# EAGLE design deploy_sch (EAGLE 9.1.0)

## Sheet 1 of 2
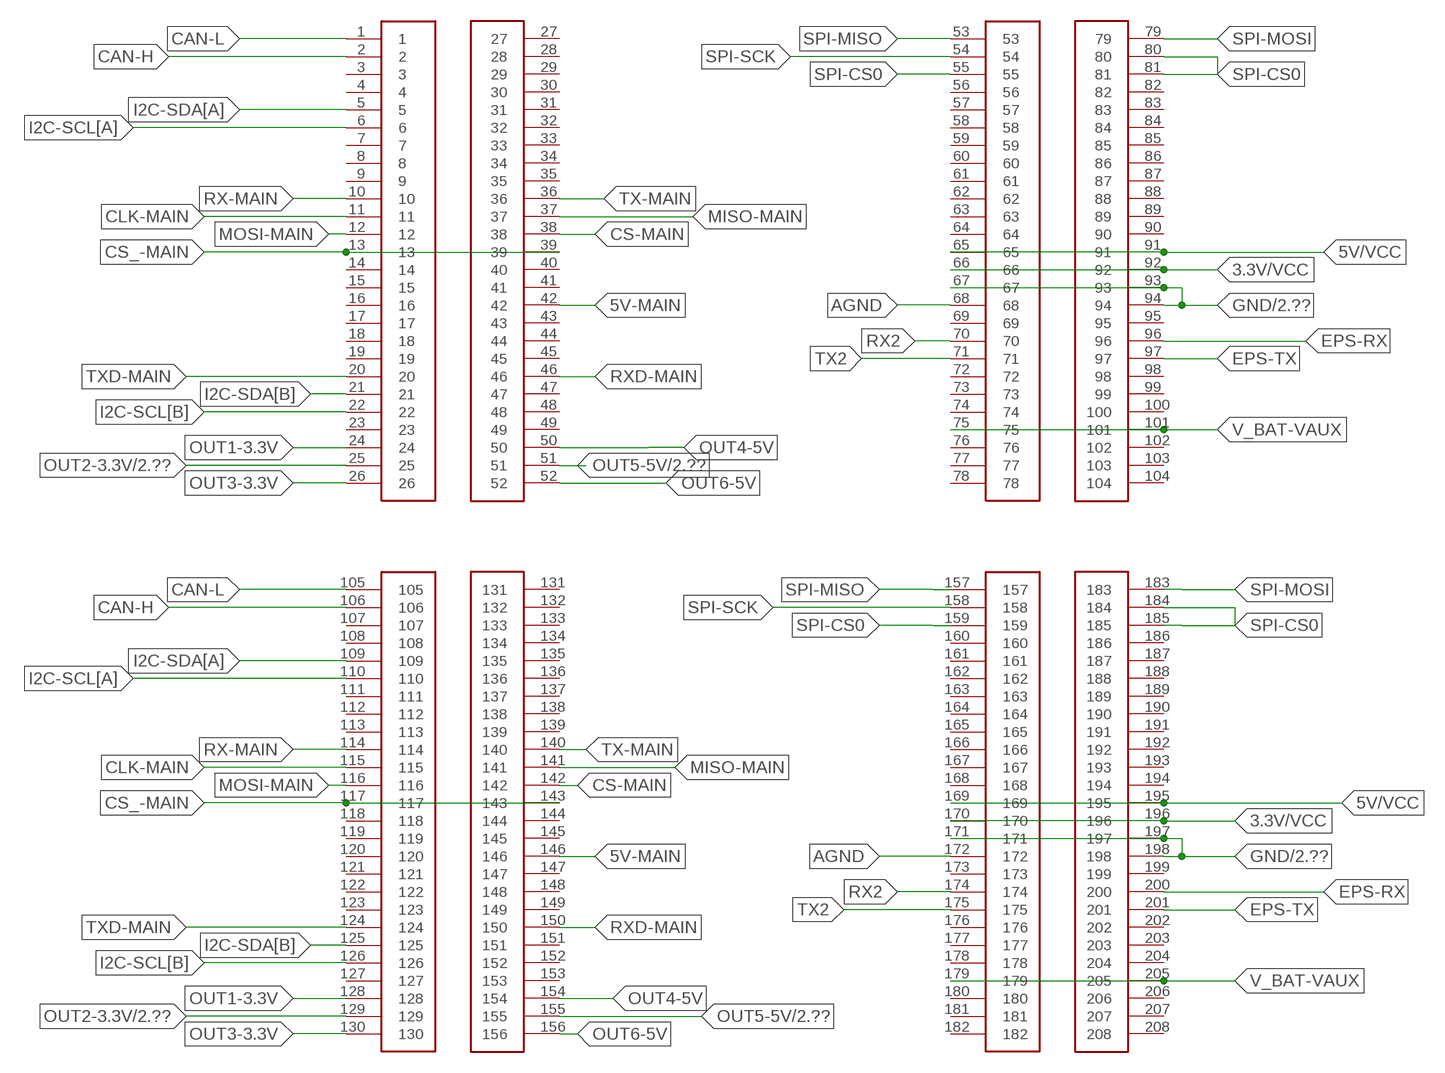
[diagram p0: schematic, sheet 1]

### Parts
U$1  SUCHAI_STACKBREAKOUT  [SUCHAI_STACKBREAKOUT]

### Nets
3.3V/VCC: U$1.66 U$1.92 U$1.170 U$1.196
5V-MAIN: U$1.42 U$1.146
5V/VCC: U$1.65 U$1.91 U$1.169 U$1.195
AGND: U$1.68 U$1.172
CAN-H: U$1.2 U$1.106
CAN-L: U$1.1 U$1.105
CLK-MAIN: U$1.11 U$1.115
CS-MAIN: U$1.38 U$1.142
CS_-MAIN: U$1.13 U$1.39 U$1.117 U$1.143
EPS-RX: U$1.96 U$1.200
EPS-TX: U$1.97 U$1.201
GND: U$1.67 U$1.93 U$1.94 U$1.171 U$1.197 U$1.198 ; also sheet 2
I2C-SCL[A]: U$1.6 U$1.110
I2C-SCL[B]: U$1.22 U$1.126
I2C-SDA[A]: U$1.5 U$1.109
I2C-SDA[B]: U$1.21 U$1.125
MISO-MAIN: U$1.37 U$1.141
MOSI-MAIN: U$1.12 U$1.116
OUT1-3.3V: U$1.24 U$1.128
OUT2-3.3V: U$1.25 U$1.129 ; also sheet 2
OUT3-3.3V: U$1.26 U$1.130
OUT4-5V: U$1.50 U$1.154
OUT5-5V: U$1.51 U$1.155 ; also sheet 2
OUT6-5V: U$1.52 U$1.156
RX2: U$1.70 U$1.174
RX-MAIN: U$1.10 U$1.114
RXD-MAIN: U$1.46 U$1.150
SPI-CS0: U$1.55 U$1.80 U$1.81 U$1.159 U$1.184 U$1.185
SPI-MISO: U$1.53 U$1.157
SPI-MOSI: U$1.79 U$1.183
SPI-SCK: U$1.54 U$1.158
TX2: U$1.71 U$1.175
TX-MAIN: U$1.36 U$1.140
TXD-MAIN: U$1.20 U$1.124
V_BAT-VAUX: U$1.75 U$1.101 U$1.179 U$1.205
Unconnected: U$1.3 U$1.4 U$1.7 U$1.8 U$1.9 U$1.14 U$1.15 U$1.16 U$1.17 U$1.18 U$1.19 U$1.23 U$1.27 U$1.28 U$1.29 U$1.30 U$1.31 U$1.32 U$1.33 U$1.34 U$1.35 U$1.40 U$1.41 U$1.43 U$1.44 U$1.45 U$1.47 U$1.48 U$1.49 U$1.56 U$1.57 U$1.58 U$1.59 U$1.60 U$1.61 U$1.62 U$1.63 U$1.64 U$1.69 U$1.72 U$1.73 U$1.74 U$1.76 U$1.77 U$1.78 U$1.82 U$1.83 U$1.84 U$1.85 U$1.86 U$1.87 U$1.88 U$1.89 U$1.90 U$1.95 U$1.98 U$1.99 U$1.100 U$1.102 U$1.103 U$1.104 U$1.107 U$1.108 U$1.111 U$1.112 U$1.113 U$1.118 U$1.119 U$1.120 U$1.121 U$1.122 U$1.123 U$1.127 U$1.131 U$1.132 U$1.133 U$1.134 U$1.135 U$1.136 U$1.137 U$1.138 U$1.139 U$1.144 U$1.145 U$1.147 U$1.148 U$1.149 U$1.151 U$1.152 U$1.153 U$1.160 U$1.161 U$1.162 U$1.163 U$1.164 U$1.165 U$1.166 U$1.167 U$1.168 U$1.173 U$1.176 U$1.177 U$1.178 U$1.180 U$1.181 U$1.182 U$1.186 U$1.187 U$1.188 U$1.189 U$1.190 U$1.191 U$1.192 U$1.193 U$1.194 U$1.199 U$1.202 U$1.203 U$1.204 U$1.206 U$1.207 U$1.208

## Sheet 2 of 2
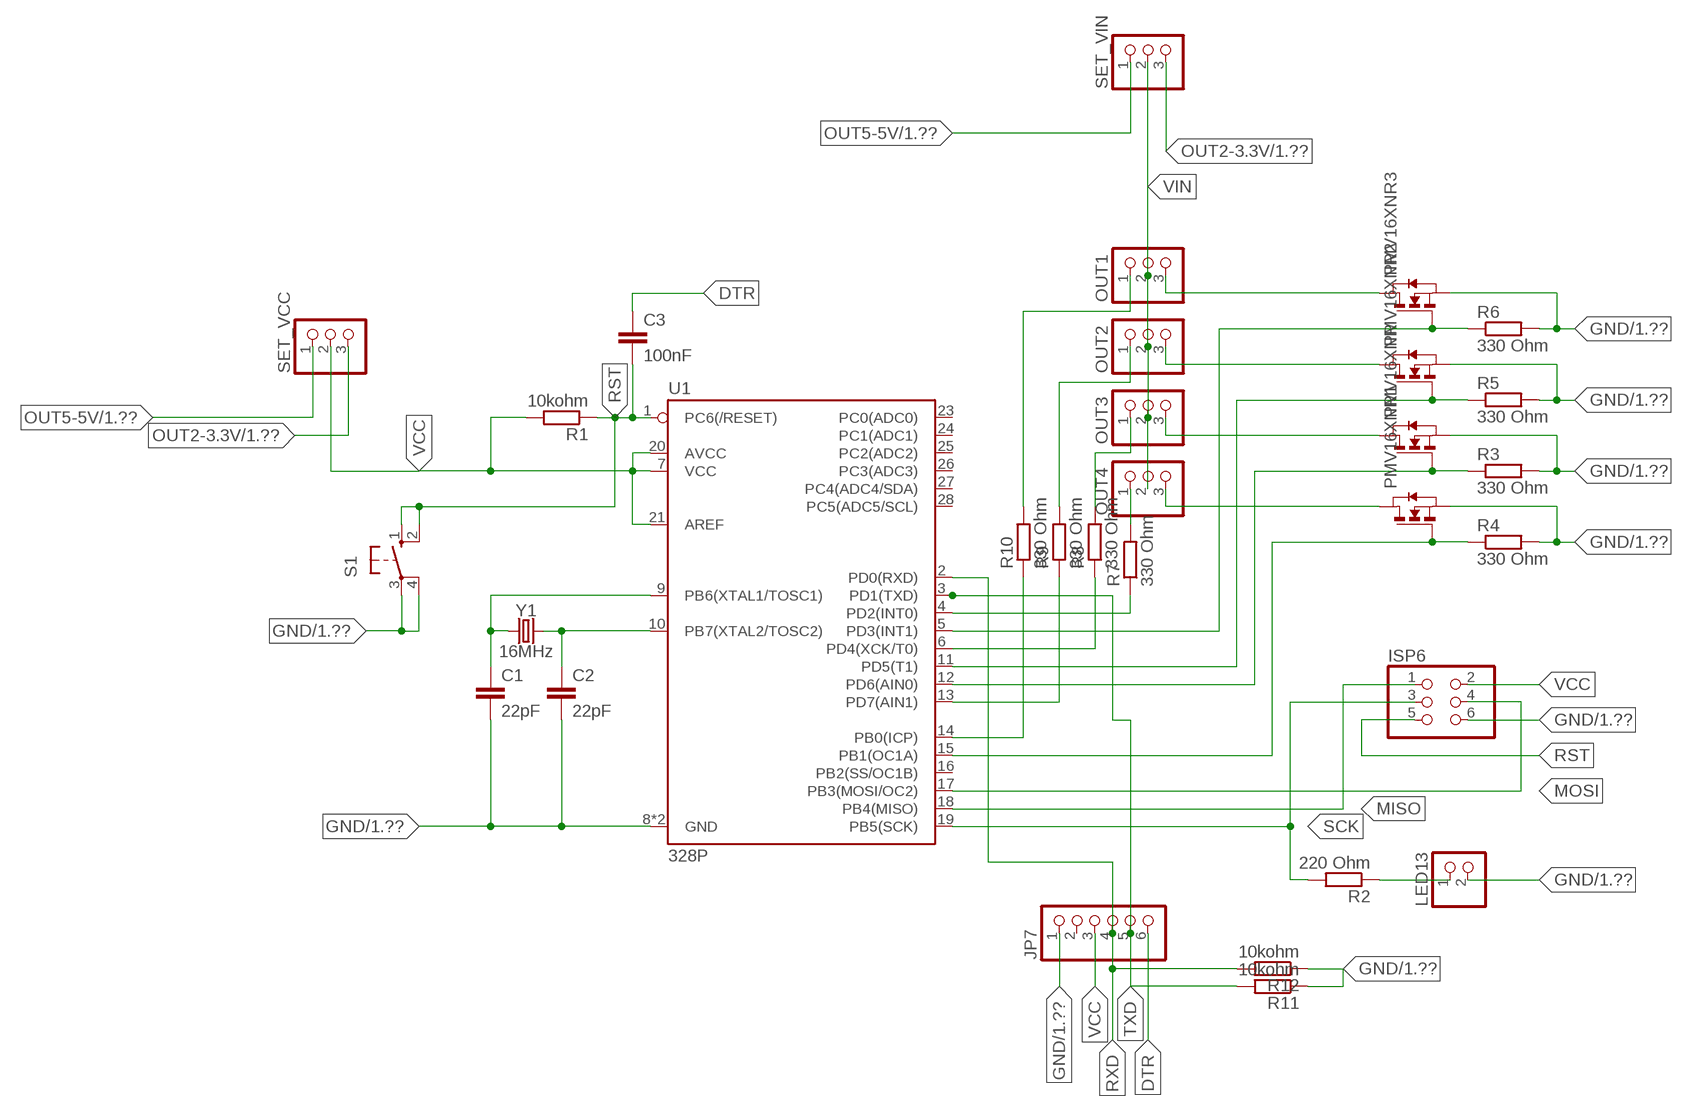
[diagram p1: schematic, sheet 2]

### Parts
C1  22pF  C-EU025-025X050  [C025-025X050]
C2  22pF  C-EU025-025X050  [C025-025X050]
C3  100nF  C-EU025-025X050  [C025-025X050]
ISP6  PINHD-2X3  [2X03]
JP7  PINHD-1X6  [1X06]
LED13  PINHD-1X2  [1X02]
OUT1  PINHD-1X3  [1X03]
OUT2  PINHD-1X3  [1X03]
OUT3  PINHD-1X3  [1X03]
OUT4  PINHD-1X3  [1X03]
PMV16XNR  NMOSSOT23  [SOT-23]
PMV16XNR1  NMOSSOT23  [SOT-23]
PMV16XNR2  NMOSSOT23  [SOT-23]
PMV16XNR3  NMOSSOT23  [SOT-23]
R1  10kohm  R-EU_0204/7  [0204/7]
R2  220 Ohm  R-EU_0204/7  [0204/7]
R3  330 Ohm  R-EU_0204/7  [0204/7]
R4  330 Ohm  R-EU_0204/7  [0204/7]
R5  330 Ohm  R-EU_0204/7  [0204/7]
R6  330 Ohm  R-EU_0204/7  [0204/7]
R7  330 Ohm  R-EU_0204/7  [0204/7]
R8  330 Ohm  R-EU_0204/7  [0204/7]
R9  330 Ohm  R-EU_0204/7  [0204/7]
R10  330 Ohm  R-EU_0204/7  [0204/7]
R11  10kohm  R-EU_0204/7  [0204/7]
R12  10kohm  R-EU_0204/7  [0204/7]
S1  10-XX  [B3F-10XX]
SET_VCC  PINHD-1X3  [1X03]
SET_VIN  PINHD-1X3  [1X03]
U1  328P  ATMEGA328P_PDIP  [DIP28]
Y1  16MHz  CRYSTAL-16MHZPTH-HC49US  [HC49US]

### Nets
DTR: C3.1 JP7.6
GND: C1.2 C2.2 ISP6.6 JP7.1 LED13.2 PMV16XNR1.2(S) PMV16XNR2.2(S) PMV16XNR3.2(S) PMV16XNR.2(S) R3.2 R4.2 R5.2 R6.2 R11.1 R12.1 S1.3(P) S1.4(P1) U1.8(GND) U1.22(GND) ; also sheet 1
MISO: ISP6.1 U1.18(PB4(MISO))
MOSI: ISP6.4 U1.17(PB3(MOSI/OC2))
N$1: C1.1 U1.9(PB6(XTAL1/TOSC1)) Y1.1
N$2: C2.1 U1.10(PB7(XTAL2/TOSC2)) Y1.2
N$3: PMV16XNR.3(G) R3.1 U1.12(PD6(AIN0))
N$4: LED13.1 R2.1
N$5: PMV16XNR1.3(G) R4.1 U1.15(PB1(OC1A))
N$6: PMV16XNR2.3(G) R5.1 U1.11(PD5(T1))
N$7: PMV16XNR3.3(G) R6.1 U1.5(PD3(INT1))
N$8: OUT4.3 PMV16XNR1.1(D)
N$9: OUT3.3 PMV16XNR.1(D)
N$10: OUT2.3 PMV16XNR2.1(D)
N$11: OUT1.3 PMV16XNR3.1(D)
N$12: OUT4.1 R7.2
N$13: R7.1 U1.4(PD2(INT0))
N$14: OUT3.1 R8.2
N$15: R8.1 U1.6(PD4(XCK/T0))
N$16: R9.1 U1.13(PD7(AIN1))
N$17: OUT2.1 R9.2
N$18: OUT1.1 R10.2
N$19: R10.1 U1.14(PB0(ICP))
OUT2-3.3V: SET_VCC.3 SET_VIN.3 ; also sheet 1
OUT5-5V: SET_VCC.1 SET_VIN.1 ; also sheet 1
RST: C3.2 ISP6.5 R1.1 S1.1(S) S1.2(S1) U1.1(PC6(/RESET))
RXD: JP7.4 R12.2 U1.2(PD0(RXD))
SCK: ISP6.3 R2.2 U1.19(PB5(SCK))
TXD: JP7.5 R11.2 U1.3(PD1(TXD))
VCC: ISP6.2 JP7.3 R1.2 SET_VCC.2 U1.7(VCC) U1.20(AVCC) U1.21(AREF)
VIN: OUT1.2 OUT2.2 OUT3.2 OUT4.2 SET_VIN.2
Unconnected: JP7.2 U1.16(PB2(SS/OC1B)) U1.23(PC0(ADC0)) U1.24(PC1(ADC1)) U1.25(PC2(ADC2)) U1.26(PC3(ADC3)) U1.27(PC4(ADC4/SDA)) U1.28(PC5(ADC5/SCL))

## Library data of the parts
C1-C3 = resistor:C-EU: CAPACITOR, European symbol
ISP6 = pinhead:PINHD-2X3: PIN HEADER
JP7 = pinhead:PINHD-1X6: PIN HEADER
LED13 = pinhead:PINHD-1X2: PIN HEADER
OUT1-OUT4 SET_VCC SET_VIN = pinhead:PINHD-1X3: PIN HEADER
PMV16XNR PMV16XNR1-PMV16XNR3 = zetex:NMOSSOT23: MOS FET; OC_FARNELL: unknown; OC_NEWARK: unknown
R1-R12 = resistor:R-EU_: RESISTOR, European symbol
S1 = switch-omron:10-XX: OMRON SWITCH; MPN: B3F-1000; OC_FARNELL: 176432; OC_NEWARK: 36M3542
U1 = SparkFun-IC-Microcontroller:ATMEGA328P_PDIP: Atmel 328P Through hole ATMEGA328P uC used in the Arduino 32kb flash, 1k EEPROM, 2k SRAM Datasheet <http://www.sparkfun.com/datasheets/Components/SMD/ATMega328.pdf> SparkFun Products Storefront component: AVR 28 Pin 20MHz 32K 6A/D - ATMega328P <https://www.sparkfun.com/products/9061> (COM-09061) SparkFun Simon Says - Through-Hole Soldering Kit <https://www.sparkfun.com/products/10547> (KIT-10547) SparkFun Learn to Solder - Simon Says <https://www.sparkfun.com/products/13708> (KIT-13708) SparkFun BigTime Watch Kit <https://www.sparkfun.com/products/11734> (KIT-11734) SparkFun ClockIt <https://www.sparkfun.com/products/10930> (KIT-10930) SparkFun Serial Enabled LCD Kit <https://www.sparkfun.com/products/10097> (LCD-10097) SparkFun Simon Tilts - Through Hole Soldering Kit <https://www.sparkfun.com/products/12634> (KIT-12634) SparkFun Frequency Counter Kit <https://www.sparkfun.com/products/10140> (KIT-10140) FabFM Radio Kit <https://www.sparkfun.com/products/11043> (KIT-11043) SparkFun Binary Blaster Kit <https://www.sparkfun.com/products/12037> (KIT-12037) SparkFun Metro-Gnome <https://www.sparkfun.com/products/9236> (KIT-09236) ATmega328 with Arduino Optiboot (Uno) <https://www.sparkfun.com/products/10524> (DEV-10524); PROD_ID: IC-09136
U$1 = SUCHAI_PCB:SUCHAI_STACKBREAKOUT
Y1 = SparkFun-Clocks:CRYSTAL-16MHZ: 16MHz Crystal Digikey Example <http://www.digikey.com/product-search/en?keywords=535-9122-1-ND> Frequency: 16MHz Frequency Stability: ±50ppm Frequency Tolerance: ±20ppm Load Capacitance: 18pF SparkFun Products: Pro Micro -5V/16MHz <https://www.sparkfun.com/products/12640> SparkFun Serial Enabled LCD Kit <https://www.sparkfun.com/products/10097>; PROD_ID: XTAL-08181; SF_ID: COM-00536

## Board
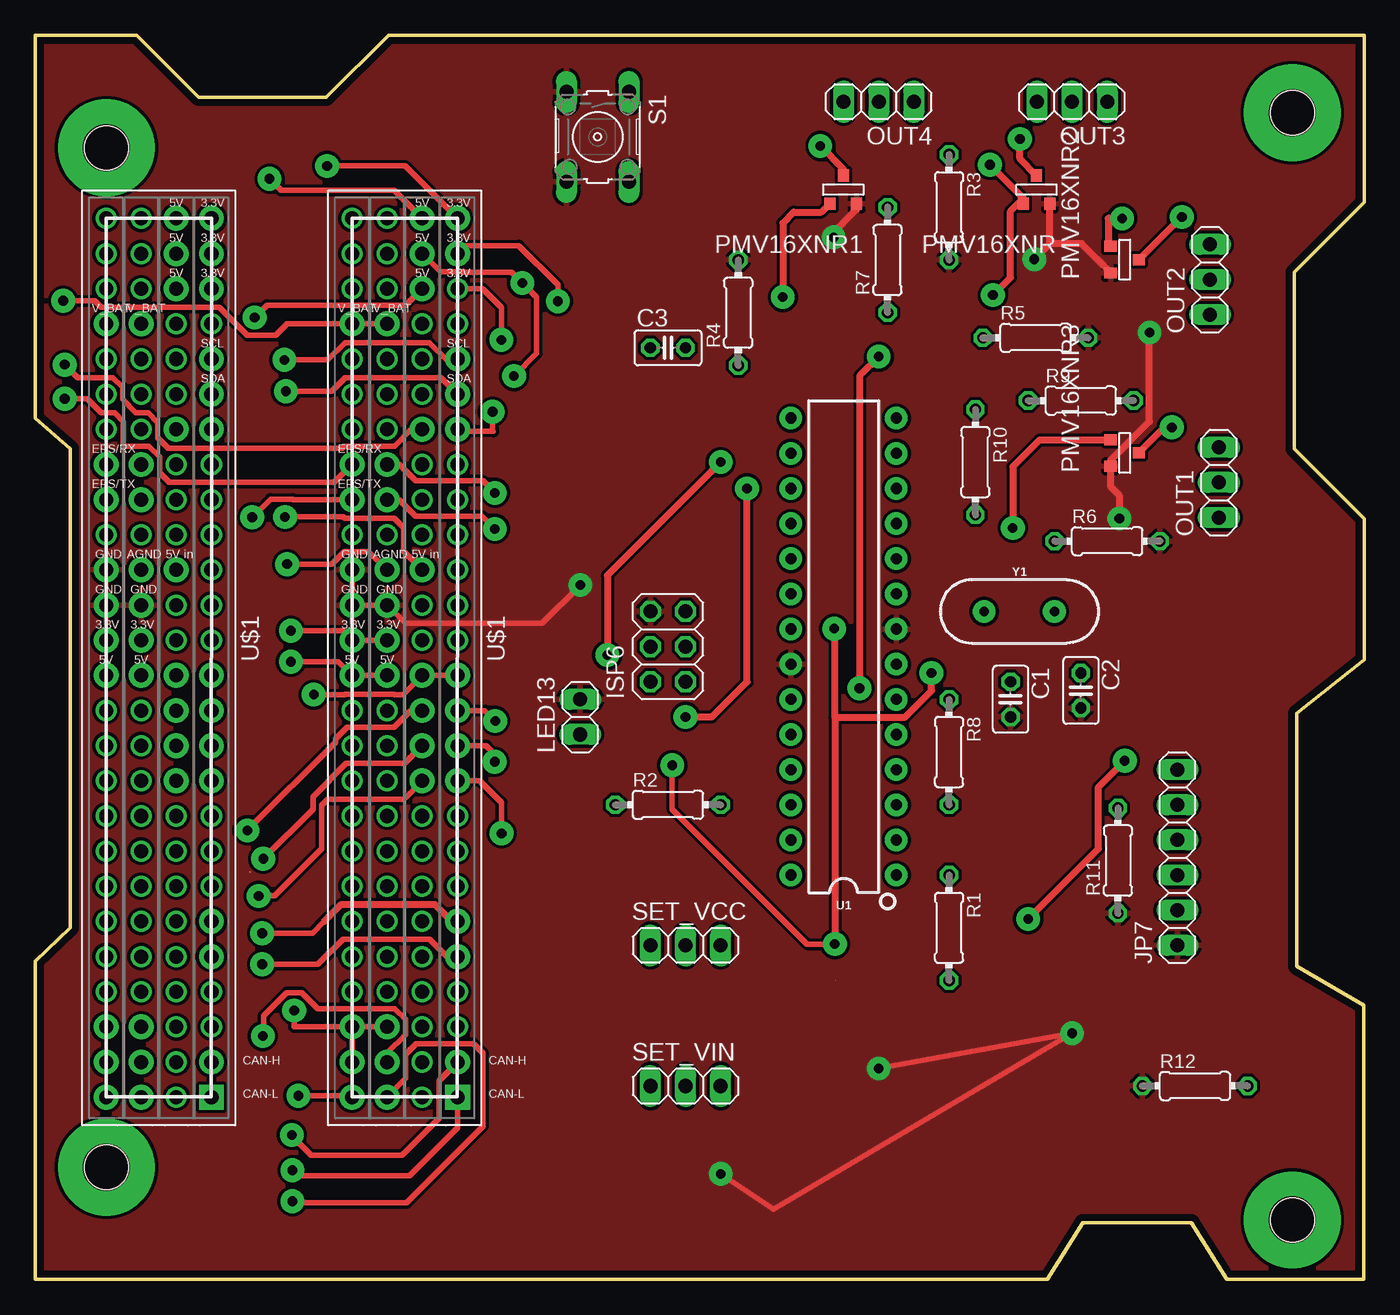
[diagram p2: board, top side]
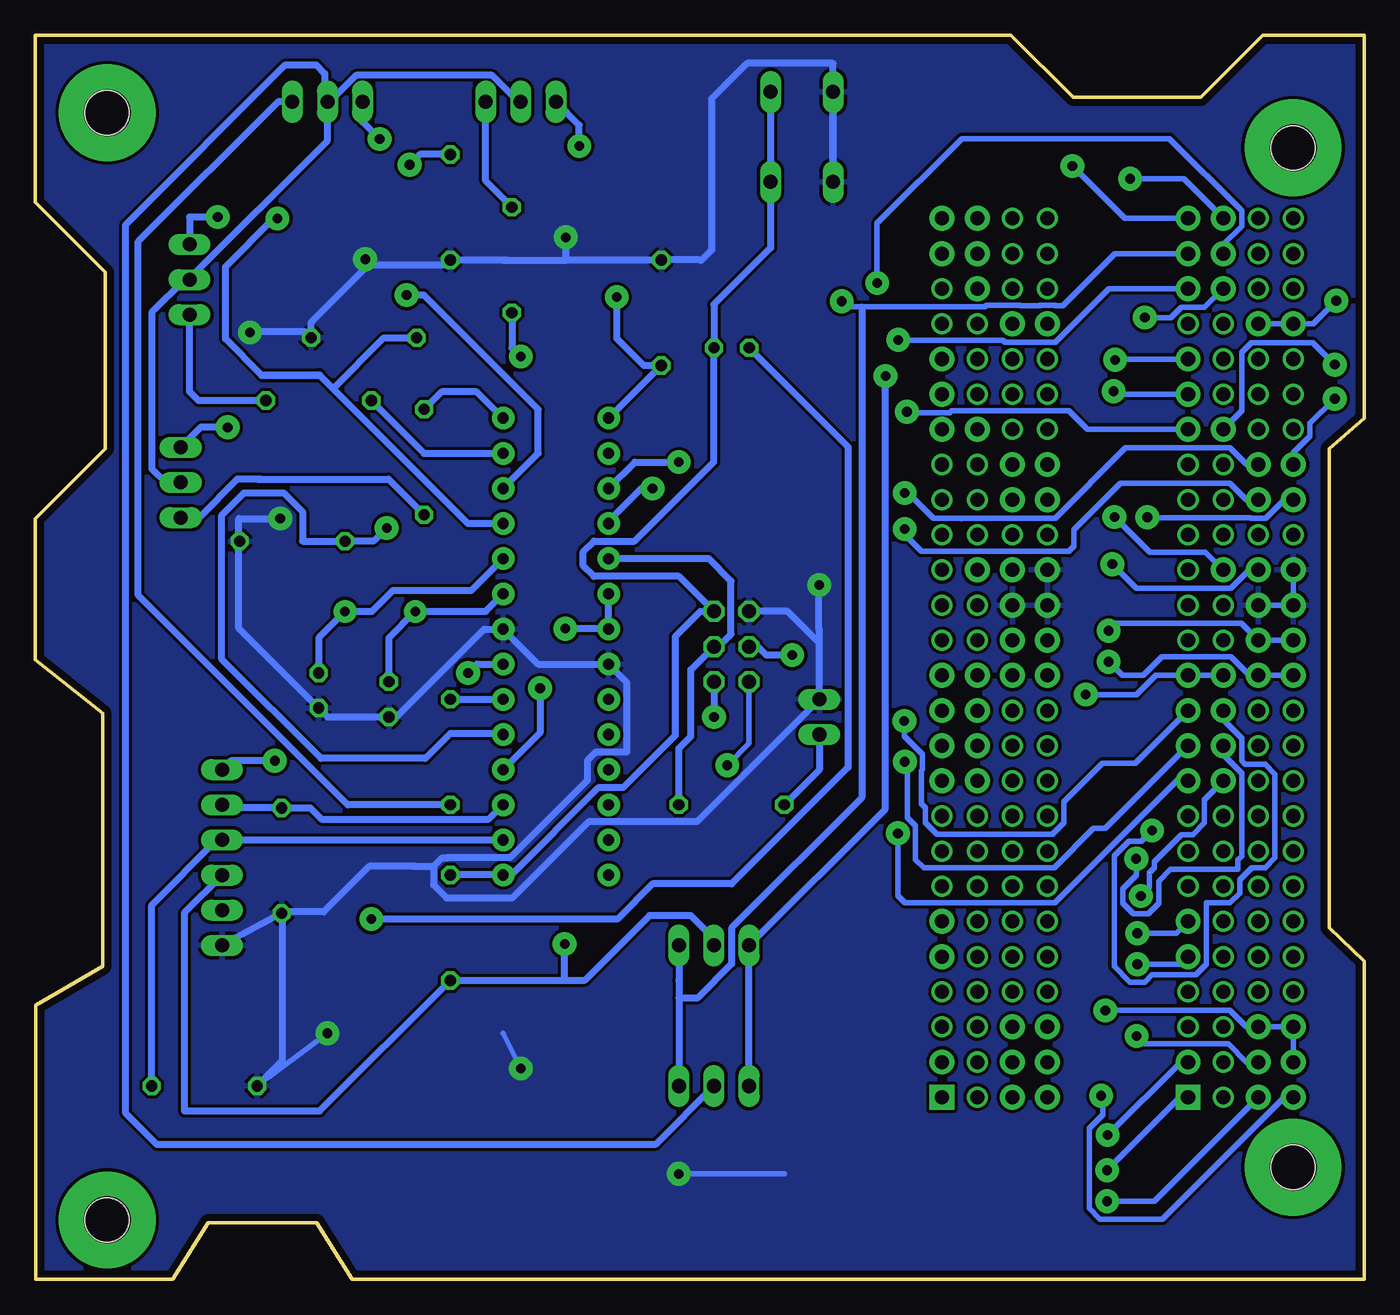
[diagram p3: board, bottom side, seen from below]

Size 96.16 x 90.01 mm. Coordinates in mm from the lower left corner, seen from the top.
Copper layers (1*16): Top 0.035mm / dielectric 1.5mm / Bottom 0.035mm
Design rules "default *": minimum track width 0.4mm, minimum drill 0.7mm, track to track 9mil, track to pad 9mil, pad to pad 9mil, via to via 9mil, smd to smd 9mil, copper to edge 20mil, drill to drill 6mil, minimum pad ring 10mil, minimum via ring 1.7mm, stop-mask expansion 4mil, vias tented up to drill 0mil, thermal gap 10mil

### Footprints (pad centres in the part's own frame; a part is rotated, then mirrored left to right if it is on the bottom)
C025-025X050 = drill 0.813 octagon: 1 -1.27,0; 2 1.27,0
2X03 = drill 1.016 octagon: 1 -2.54,-1.27; 2 -2.54,1.27; 3 0,-1.27; 4 0,1.27; 5 2.54,-1.27; 6 2.54,1.27
1X06 = drill 1.016 long: 1 -6.35,0; 2 -3.81,0; 3 -1.27,0; 4 1.27,0; 5 3.81,0; 6 6.35,0
1X02 = drill 1.016 long: 1 -1.27,0; 2 1.27,0
1X03 = drill 1.016 long: 1 -2.54,0; 2 0,0; 3 2.54,0
SOT-23 = smd 0.787 x 0.889: 1 0.025,-1.016; 2 -0.94,1.016; 3 0.991,1.016
0204/7 = drill 0.813 octagon: 1 -3.81,0; 2 3.81,0
B3F-10XX = drill 1.016 long: 1 -3.251,2.261; 2 3.251,2.261; 3 -3.251,-2.261; 4 3.251,-2.261
DIP28 = drill 0.813 pad 1.626: 1 -16.51,-3.81; 2 -13.97,-3.81; 3 -11.43,-3.81; 4 -8.89,-3.81; 5 -6.35,-3.81; 6 -3.81,-3.81; 7 -1.27,-3.81; 8 1.27,-3.81; 9 3.81,-3.81; 10 6.35,-3.81; 11 8.89,-3.81; 12 11.43,-3.81; 13 13.97,-3.81; 14 16.51,-3.81; 15 16.51,3.81; 16 13.97,3.81; 17 11.43,3.81; 18 8.89,3.81; 19 6.35,3.81; 20 3.81,3.81; 21 1.27,3.81; 22 -1.27,3.81; 23 -3.81,3.81; 24 -6.35,3.81; 25 -8.89,3.81; 26 -11.43,3.81; 27 -13.97,3.81; 28 -16.51,3.81
SUCHAI_STACKBREAKOUT = drill 1.016 pad 1.8 square: 1 12.72,13.16; 105 30.5,13.16 | drill 1.016 pad 1.8: 2 12.72,15.7; 5 12.72,23.32; 6 12.72,25.86; 10 12.72,36.02; 11 12.72,38.56; 12 12.72,41.1; 13 12.72,43.64; 20 12.72,61.42; 21 12.72,63.96; 22 12.72,66.5; 24 12.72,71.58; 25 12.72,74.12; 26 12.72,76.66; 36 10.18,36.02; 37 10.18,38.56; 38 10.18,41.1; 39 10.18,43.64; 42 10.18,51.26; 46 10.18,61.42; 50 10.18,71.58; 51 10.18,74.12; 52 10.18,76.66; 53 7.64,13.16; 54 7.64,15.7; 55 7.64,18.24; 65 7.64,43.64; 66 7.64,46.18; 67 7.64,48.72; 68 7.64,51.26; 70 7.64,56.34; 71 7.64,58.88; 75 7.64,69.04; 79 5.1,13.16; 80 5.1,15.7; 81 5.1,18.24; 91 5.1,43.64; 92 5.1,46.18; 93 5.1,48.72; 94 5.1,51.26; 96 5.1,56.34; 97 5.1,58.88; 101 5.1,69.04; 106 30.5,15.7; 109 30.5,23.32; 110 30.5,25.86; 114 30.5,36.02; 115 30.5,38.56; 116 30.5,41.1; 117 30.5,43.64; 124 30.5,61.42; 125 30.5,63.96; 126 30.5,66.5; 129 30.5,74.12; 130 30.5,76.66; 140 27.96,36.02; 141 27.96,38.56; 142 27.96,41.1; 143 27.96,43.64; 146 27.96,51.26; 150 27.96,61.42; 154 27.96,71.58; 155 27.96,74.12; 156 27.96,76.66; 157 25.42,13.16; 158 25.42,15.7; 159 25.42,18.24; 169 25.42,43.64; 170 25.42,46.18; 171 25.42,48.72; 172 25.42,51.26; 174 25.42,56.34; 175 25.42,58.88; 179 25.42,69.04; 183 22.88,13.16; 184 22.88,15.7; 185 22.88,18.24; 195 22.88,43.64; 196 22.88,46.18; 197 22.88,48.72; 198 22.88,51.26; 200 22.88,56.34; 201 22.88,58.88; 205 22.88,69.04 | drill 1.016 pad 1.524: 3 12.72,18.24; 4 12.72,20.78; 7 12.72,28.4; 8 12.72,30.94; 9 12.72,33.48; 14 12.72,46.18; 15 12.72,48.72; 16 12.72,51.26; 17 12.72,53.8; 18 12.72,56.34; 19 12.72,58.88; 23 12.72,69.04; 27 10.18,13.16; 28 10.18,15.7; 29 10.18,18.24; 30 10.18,20.78; 31 10.18,23.32; 32 10.18,25.86; 33 10.18,28.4; 34 10.18,30.94; 35 10.18,33.48; 40 10.18,46.18; 41 10.18,48.72; 43 10.18,53.8; 44 10.18,56.34; 45 10.18,58.88; 47 10.18,63.96; 48 10.18,66.5; 49 10.18,69.04; 56 7.64,20.78; 57 7.64,23.32; 58 7.64,25.86; 59 7.64,28.4; 60 7.64,30.94; 61 7.64,33.48; 62 7.64,36.02; 63 7.64,38.56; 64 7.64,41.1; 69 7.64,53.8; 72 7.64,61.42; 73 7.64,63.96; 74 7.64,66.5; 76 7.64,71.58; 77 7.64,74.12; 78 7.64,76.66; 82 5.1,20.78; 83 5.1,23.32; 84 5.1,25.86; 85 5.1,28.4; 86 5.1,30.94; 87 5.1,33.48; 88 5.1,36.02; 89 5.1,38.56; 90 5.1,41.1; 95 5.1,53.8; 98 5.1,61.42; 99 5.1,63.96; 100 5.1,66.5; 102 5.1,71.58; 103 5.1,74.12; 104 5.1,76.66; 107 30.5,18.24; 108 30.5,20.78; 111 30.5,28.4; 112 30.5,30.94; 113 30.5,33.48; 118 30.5,46.18; 119 30.5,48.72; 120 30.5,51.26; 121 30.5,53.8; 122 30.5,56.34; 123 30.5,58.88; 127 30.5,69.04; 128 30.5,71.58; 131 27.96,13.16; 132 27.96,15.7; 133 27.96,18.24; 134 27.96,20.78; 135 27.96,23.32; 136 27.96,25.86; 137 27.96,28.4; 138 27.96,30.94; 139 27.96,33.48; 144 27.96,46.18; 145 27.96,48.72; 147 27.96,53.8; 148 27.96,56.34; 149 27.96,58.88; 151 27.96,63.96; 152 27.96,66.5; 153 27.96,69.04; 160 25.42,20.78; 161 25.42,23.32; 162 25.42,25.86; 163 25.42,28.4; 164 25.42,30.94; 165 25.42,33.48; 166 25.42,36.02; 167 25.42,38.56; 168 25.42,41.1; 173 25.42,53.8; 176 25.42,61.42; 177 25.42,63.96; 178 25.42,66.5; 180 25.42,71.58; 181 25.42,74.12; 182 25.42,76.66; 186 22.88,20.78; 187 22.88,23.32; 188 22.88,25.86; 189 22.88,28.4; 190 22.88,30.94; 191 22.88,33.48; 192 22.88,36.02; 193 22.88,38.56; 194 22.88,41.1; 199 22.88,53.8; 202 22.88,61.42; 203 22.88,63.96; 204 22.88,66.5; 206 22.88,71.58; 207 22.88,74.12; 208 22.88,76.66 | drill 3.4 pad 7: P$1 5.13,8.1; P$2 5.13,81.76; P$3 90.86,4.29; P$4 90.86,84.3 | hole 3.2: 5.13,8.1; 90.86,4.29; 90.86,84.3; 5.13,81.76
HC49US = drill 0.7 pad 1.651: 1 -2.54,0; 2 2.54,0

### Placement (x,y rotation side)
C1  70.55,41.97 270 top
C2  75.63,42.61 270 top
C3  45.78,67.37 0 top
ISP6  45.78,45.78 90 top
JP7  82.61,30.54 90 top
LED13  39.43,40.7 90 top
OUT1  85.6,57.64 90 top
OUT2  84.96,72.3 90 top
OUT3  74.99,85.15 180 top
OUT4  61.02,85.15 180 top
PMV16XNR  72.45,78.8 180 top
PMV16XNR1  58.48,78.8 180 top
PMV16XNR2  78.8,73.72 90 top
PMV16XNR3  78.8,59.75 90 top
R1  66.1,25.46 270 top
R2  45.78,34.35 0 top
R3  66.1,77.53 270 top
R4  50.86,69.91 90 top
R5  72.36,68.1 0 top
R6  77.53,53.4 0 top
R7  61.66,73.72 90 top
R8  66.1,38.16 270 top
R9  75.63,63.56 0 top
R10  68.01,59.12 270 top
R11  78.31,30.32 90 top
R12  83.88,14.03 0 top
S1  40.7,82.61 270 top
SET_VCC  47.05,24.19 0 top
SET_VIN  47.05,14.03 0 top
U1  58.48,45.78 90 top
U$1  0.06,0.06 0 top
Y1  71.18,48.32 0 top

### Tracks (layer width: path | path; a pad name or v marks a point on that pad's centre or on a via)
3.3V/VCC  (via drill 0.7)
  Top 0.4: U$1.170 U$1.196 22.26,46.93 v18.52,46.93
  Bottom 0.4: U$1.92 U$1.66 8.93,47.47 17.98,47.47 v18.52,46.93
5V-MAIN  (via drill 0.7)
  Top 0.4: v18.11,55.16 22.31,55.16 22.41,55.05 25.98,55.05 26.67,54.36 26.67,52.67 U$1.146
  Bottom 0.4: v18.11,55.16 15.56,52.61 11.53,52.61 U$1.42
5V/VCC  (via drill 0.7)
  Top 0.4: U$1.169 U$1.195 21.96,44.69 v18.53,44.69
  Bottom 0.4: U$1.91 U$1.65 8.36,43.7 9.69,45.03 14.68,45.03 16.01,43.7 17.54,43.7 v18.53,44.69
AGND  (via drill 0.7)
  Top 0.4: v18.26,51.74 21.48,51.74 22.39,52.65 24.15,52.65 U$1.172
  Bottom 0.4: U$1.68 8.36,51.32 9.69,49.99 16.51,49.99 v18.26,51.74
CAN-H  (via drill 0.7)
  Top 0.4: U$1.106 29.23,14.43 29.23,11.7 26.57,9.04 20,9.04 18.59,10.45 v18.59,10.5
  Bottom 0.4: v18.59,10.5 13.32,15.76 U$1.2
CAN-L  (via drill 0.7)
  Top 0.4: U$1.105 30.56,11.02 27.1,7.55 19.04,7.55 v18.64,7.94
  Bottom 0.4: U$1.1 13.36,13.22 v18.64,7.94
CLK-MAIN  (via drill 0.7)
  Top 0.4: v33.26,37.46 33.26,38 32.64,38.62 U$1.115
  Bottom 0.4: v33.26,37.46 33.08,37.28 33.08,33.43 32.47,32.82 32.47,30.39 31.89,29.81 22.45,29.81 19.62,32.64 18.76,32.64 U$1.11
CS-MAIN  (via drill 0.7)
  Top 0.4: v15.38,32.5 21.75,38.88 21.75,39.12 22.61,39.97 25.98,39.97 27.17,41.16 U$1.142
  Bottom 0.4: U$1.38 10.24,40.5 8.91,39.17 8.91,37.52 8.67,37.27 7.21,37.27 6.51,36.58 6.51,30.51 7.21,29.81 8.19,29.81 9.05,28.95 9.05,27.97 9.75,27.27 11.45,27.27 11.45,22.83 12.23,22.05 15.4,22.05 15.91,21.55 16.98,21.55 18.11,22.68 18.11,30.68 17.06,31.73 16.15,31.73 v15.38,32.5
CS_-MAIN  (via drill 0.7)
  Top 0.4: U$1.117 U$1.143 26.64,42.32 26.01,42.32 25.98,42.35 22.45,42.35 22.41,42.32 v20.18,42.32
  Bottom 0.4: U$1.39 U$1.13 15.12,43.7 16.51,42.32 v20.18,42.32
DTR  (via drill 0.7)
  Top 0.5: v71.82,26.1 76.9,31.18 76.9,35.62 v78.8,37.53
  Bottom 0.5: C3.1 37.36,60.22 37.36,37.06 45.78,28.64 51.5,28.64 54.04,26.1 v71.82,26.1 | v78.8,37.53 81.98,37.53 JP7.6
EPS-RX  (via drill 0.7)
  Top 0.4: U$1.200 18.68,56.4 18.64,56.44 17.05,56.44 v15.73,55.12
  Bottom 0.4: U$1.96 5.82,56.4 7.15,55.07 8.25,55.07 8.27,55.09 15.7,55.09 v15.73,55.12
EPS-TX  (via drill 0.7)
  Top 0.4: v2.18,63.7 3.8,63.7 4.83,62.67 5.78,62.67 6.41,62.05 6.41,60.27 8.25,60.27 9.03,59.49 9.03,58.36 9.74,57.65 21.65,57.65 U$1.201
  Bottom 0.4: v2.18,63.7 3.97,61.91 3.97,60.99 5.16,59.8 U$1.97
GND  (via drill 0.7)
  Top 0.4: U$1.197 U$1.171 26.81,47.46 36.69,47.46 v39.45,50.23 | U$1.197 U$1.198 | 22.52,49.21 U$1.197 | v49.59,7.68 53.4,5.14 v74.99,17.84 v61.02,15.3
  Top 0.5: v57.77,75.36 57.41,75.36 59.42,77.37 PMV16XNR1.2 | v72.26,73.77 73.39,74.9 | 73.39,74.9 PMV16XNR.2 | PMV16XNR2.2 75.67,74.9 73.39,74.9 | v80.59,68.49 80.59,62.06 77.79,59.25 PMV16XNR3.2 77.79,57.34 78.41,56.71 v78.41,55.03 | 39.65,50.23 v39.45,50.23
  Bottom 0.4: U$1.67 U$1.93 U$1.94 | R12.1 v74.99,17.84 | v49.59,7.68 41.97,7.68 | v61.02,15.3 62.29,17.84
  Bottom 0.5: S1.3 S1.4 38.44,87.93 44.68,87.93 47.23,85.38 47.23,74.44 48,73.67 48.13,73.72 R4.2 50.9,73.69 57.77,73.69 | 61.89,73.69 62.29,73.69 | 62.29,73.69 66.07,73.69 R3.2 66.47,73.36 71.85,73.36 v72.26,73.77 72.26,73.13 76.17,69.23 R5.2 76.63,68.56 80.52,68.56 v80.59,68.49 | v57.77,75.36 57.77,73.69 | R6.2 81.41,53.47 | 81.41,53.47 81.41,55.03 v78.41,55.03 | ISP6.6 41.73,48.32 39.43,46.03 LED13.2 | R11.1 JP7.1 | R12.1 78.27,15.84 78.27,26.46 R11.1 | 67.33,29.92 67.33,28.57 66.38,27.63 61.61,27.63 56.08,33.16 48.25,33.16 LED13.2 | 81.41,53.47 81.41,47.12 C2.2 74.99,40.7 C1.2 70.01,40.7 63.66,47.05 U1.8 59.75,44.51 U1.22 53.36,43.2 53.36,38.16 55.6,38.16 56.23,37.53 56.23,36.09 61.78,30.54 66.31,30.54 66.33,30.52 66.72,30.52 67.33,29.92 | 68.86,29.92 68.64,29.92 | R11.1 78.2,26.62 75.26,26.62 71.97,29.91 68.66,29.91 68.64,29.92 | LED13.2 39.43,47.05 39.45,47.03 v39.45,50.23 | 62.29,73.69 57.77,73.69 | 68.64,29.92 67.33,29.92
  pour Bottom: 0.1,89.92 7.45,89.92 7.45,89.98 11.85,85.58 11.85,85.32 21.02,85.32 21.17,85.47 25.57,89.87 26.09,89.87 96.08,89.87 96.13,89.82 96.13,77.96 96.03,77.86 91.01,72.84 91.01,59.94 96.19,54.77 96.19,44.77 91.37,39.96 91.37,22.56 96.13,19.82 96.13,0.09 86.19,0.09 83.55,4.18 75.68,4.18 73.25,0.09 -0.03,0.09 -0.03,22.91 2.54,25.48 2.54,25.49 2.54,60.04 2.58,60.07 0.09,62.57 0.09,89.93 0.09,89.93
  pour Top: 0.06,0.06 73.72,0.06 76.26,3.87 83.88,3.87 86.42,0.06 96.58,0.06 96.58,20.38 91.5,22.92 91.5,40.7 96.58,44.51 96.58,54.67 91.5,59.75 91.5,72.45 96.58,77.53 96.58,90.23 25.46,90.23 20.38,85.15 11.49,85.15 7.68,90.23 0.06,90.23 0.06,62.29 2.6,59.75 2.6,25.46 0.06,22.92
I2C-SCL[A]  (via drill 0.7)
  Top 0.4: v16.45,25.08 20.09,25.08 20.94,25.92
  Top 0.5: U$1.110 30.15,25.92 28.92,27.16 22.17,27.16 20.94,25.92
  Bottom 0.4: U$1.6 13.63,25.08 v16.45,25.08
I2C-SCL[B]  (via drill 0.7)
  Top 0.4: U$1.126 30.5,66.5 29.77,66.5 28.52,67.75 22.45,67.75 21.2,66.5 v18.06,66.5
  Bottom 0.4: U$1.22 18,66.56 v18.06,66.5
I2C-SDA[A]  (via drill 0.7)
  Top 0.4: U$1.109 29.82,23.38 28.56,24.65 22.29,24.65 20.48,22.83 v16.45,22.83
  Bottom 0.4: U$1.5 13.33,22.83 v16.45,22.83
I2C-SDA[B]  (via drill 0.7)
  Top 0.4: v18.17,64.24 21.48,64.24 22.45,65.21 29.37,65.21 U$1.125
  Bottom 0.4: U$1.21 17.95,64.02 v18.17,64.24
MISO  (via drill 0.7)
  Top 0.5: v47.05,40.7 48.96,40.7 51.5,43.24 v51.5,57.21
  Bottom 0.5: ISP6.1 v47.05,40.7 | v51.5,57.21 52.29,57.21 54.67,54.83 U1.18
MISO-MAIN  (via drill 0.7)
  Top 0.4: v16.53,30.45 20.13,34.04 20.13,34.95 22.53,37.35 26.75,37.35 U$1.141
  Bottom 0.4: U$1.37 10.24,37.96 8.91,36.63 8.91,30.65 9.2,30.36 9.2,29.69 14.06,29.69 14.91,28.84 14.91,27.23 15.67,26.48 16.73,26.48 17.49,27.23 17.49,28.3 16.53,29.25 v16.53,30.45
MOSI  (via drill 0.7)
  Top 0.5: v49.59,59.12 41.4,50.92 v41.4,45.17
  Bottom 0.5: U1.17 52.77,59.12 v49.59,59.12 | v41.4,45.17 43.27,45.17 43.88,45.78 ISP6.4
MOSI-MAIN  (via drill 0.7)
  Top 0.4: v33.29,40.41 32.54,41.16 U$1.116
  Bottom 0.4: U$1.12 16.58,37.37 18.96,37.37 21.75,34.58 21.75,33.05 22.59,32.22 30.92,32.22 31.75,33.05 31.75,34.13 32.07,34.45 32.07,36.83 31.97,36.93 31.97,38 33.29,39.32 v33.29,40.41
N$1
  Bottom 0.5: C1.1 70.55,46.42 Y1.1 63.56,48.32 U1.9
N$2
  Bottom 0.5: U1.10 64.58,49.85 70.25,49.85 71.78,48.32 Y1.2 75.63,46.42 C2.1
N$3  (via drill 0.7)
  Top 0.5: v69.05,80.61 71.46,78.2 71.46,78.17 | 71.46,78.17 PMV16XNR.3 | v69.28,71.18 70.55,72.45 70.55,77.25 71.46,78.17
  Bottom 0.5: R3.1 68.31,81.34 v69.05,80.61 | U1.12 59.75,59.75 59.75,62.93 68.01,71.18 v69.28,71.18
N$4
  Bottom 0.5: LED13.1 39.43,36.89 R2.1
N$5  (via drill 0.7)
  Top 0.5: PMV16XNR1.3 56.88,77.17 54.87,77.17 54.09,76.39 v54.09,71.04
  Bottom 0.5: U1.15 R4.1 52.13,66.1 54.09,68.06 v54.09,71.04
N$6  (via drill 0.7)
  Top 0.5: v78.61,76.72 77.6,76.72 77.6,74.9 PMV16XNR2.3
  Bottom 0.5: 79.75,65.41 82.36,68.02 82.36,73.23 78.87,76.72 v78.61,76.72 | 74.59,64.43 75.57,65.41 | 74.59,64.43 70.92,68.1 R5.1 | U1.11 64.83,54.67 74.59,64.43
  Bottom 0.55: 79.75,65.41 75.57,65.41
N$7  (via drill 0.7)
  Top 0.5: PMV16XNR3.3 77.74,60.7 72.64,60.7 70.71,58.78 v70.71,54.36
  Bottom 0.5: v70.71,54.36 71.67,53.4 R6.1 76.79,53.4 76.79,55.53 78.16,56.9 81.02,56.9 82.62,55.29 82.62,44.87 75.46,37.7 67.91,37.7 66.12,39.49 62.51,39.49 62.45,39.43 U1.5
N$8  (via drill 0.7)
  Top 0.5: PMV16XNR1.1 58.46,80.29 v56.79,81.96
  Bottom 0.5: v56.79,81.96 56.79,83.46 OUT4.3
N$9  (via drill 0.7)
  Top 0.5: PMV16XNR.1 71.23,81.02 v71.23,82.47
  Bottom 0.5: v71.23,82.47 72.45,83.69 OUT3.3
N$10  (via drill 0.7)
  Top 0.5: PMV16XNR2.1 82.9,76.83 v82.93,76.83
  Bottom 0.5: v82.93,76.83 84.96,76.83 OUT2.3
N$11  (via drill 0.7)
  Top 0.5: PMV16XNR3.1 81.64,61.6 82.19,61.6 v82.21,61.63
  Bottom 0.5: v82.21,61.63 84.16,61.63 OUT1.3
N$12
  Bottom 0.5: R7.2 63.56,79.44 OUT4.1
N$13  (via drill 0.7)
  Top 0.5: v61.02,66.74 59.63,65.34 v59.63,42.77
  Bottom 0.5: R7.1 61.66,67.37 v61.02,66.74 | v59.63,42.77 59.63,39.56 U1.4
N$14
  Bottom 0.5: R8.2 73.52,34.35 88.66,49.49 88.66,75.06 78.57,85.15 OUT3.1
N$15
  Bottom 0.5: R8.1 U1.6
N$16
  Bottom 0.5: R9.1 68.01,59.75 U1.13
N$17
  Bottom 0.5: R9.2 84.32,63.56 84.96,64.2 OUT2.1
N$18
  Bottom 0.5: OUT1.1 84.28,55.1 81.51,57.88 80.07,57.88 | 79.81,57.88 80.07,57.88 | 80.07,57.88 70.58,57.88 R10.2
N$19
  Bottom 0.5: U1.14 64.2,64.2 66.74,64.2 R10.1
OUT1-3.3V  (via drill 0.7)
  Top 0.4: v33.74,67.95 33.74,70.28 32.38,71.64 U$1.128
  Bottom 0.4: U$1.24 18.52,71.64 22.39,67.77 26.03,67.77 26.17,67.91 33.7,67.91 v33.74,67.95
OUT2-3.3V  (via drill 0.7)
  Top 0.4: U$1.129 31.14,74.76 34.99,74.76 37.82,71.92 v37.82,70.74
  Bottom 0.4: U$1.25 18.07,74.18 21.83,70.42 22.38,70.42 22.39,70.43 23.49,70.43 23.51,70.42 24.92,70.42 24.93,70.43 27.36,70.43 27.46,70.33 36.37,70.33 37.41,70.33 v37.82,70.74
  Bottom 0.5: 49.59,20.38 49.59,21.65 SET_VCC.3 | 49.59,20.38 SET_VIN.3 | 36.37,70.33 36.37,34.88 45.78,25.47 45.78,22.86 48.25,20.38 49.59,20.38
OUT3-3.3V  (via drill 0.7)
  Top 0.4: v21.15,80.52 26.77,80.52 U$1.130
  Bottom 0.4: U$1.26 17.35,76.72 v21.15,80.52
OUT4-5V  (via drill 0.7)
  Top 0.4: v15.9,69.56 16.8,70.46 22.45,70.46 22.45,70.45 26.83,70.45 U$1.154
  Bottom 0.4: U$1.50 11.59,70.29 13.28,70.29 14.01,69.56 v15.9,69.56
OUT5-5V  (via drill 0.7)
  Top 0.4: U$1.155 29.35,72.85 31.04,72.85 31.06,72.83 34.48,72.83 v35.26,72.05 36.29,71.02 36.29,66.98 v34.65,65.34
  Bottom 0.4: v34.66,65.33 v34.65,65.34 | U$1.51 10.24,74.84 8.91,76.17 8.91,77.27 14.14,82.5 29.13,82.5 35.26,76.37 v35.26,72.05
  Bottom 0.5: SET_VIN.1 SET_VCC.1 34.66,34.04 v34.66,65.33
OUT6-5V  (via drill 0.7)
  Top 0.4: v16.98,79.58 17.81,78.76 25.99,78.76 U$1.156
  Bottom 0.4: U$1.52 13.1,79.58 v16.98,79.58
RST
  Bottom 0.5: S1.1 S1.2 42.96,74.6 47.05,70.51 C3.2 47.05,59.13 52.79,53.4 55.73,53.4 56.5,52.63 56.5,51.64 55.73,50.86 49.59,50.86 ISP6.5 48.03,48.32 49.84,46.51 49.84,39.37 53.6,35.61 55.39,35.61 61.69,29.31 62.26,29.31 U1.1 62.35,29.33 66.05,29.33 R1.1
RX2  (via drill 0.7)
  Top 0.4: v33.27,54.29 32.35,55.21 27.53,55.21 26.34,56.4 U$1.174
  Bottom 0.4: U$1.70 8.56,56.4 9.75,57.59 17.66,57.59 21.03,54.23 21.03,53.03 21.38,52.67 32.05,52.67 33.27,53.9 v33.27,54.29
RX-MAIN  (via drill 0.7)
  Top 0.4: v33.76,32.29 33.76,34.5 32.18,36.08 U$1.114
  Bottom 0.4: v33.76,32.29 33.75,32.28 33.75,27.77 33.26,27.29 22.41,27.29 13.49,36.21 12.91,36.21 U$1.10
RXD
  Bottom 0.5: R12.2 87.69,27.11 82.99,31.81 JP7.4 U1.2
RXD-MAIN  (via drill 0.7)
  Top 0.4: v2.18,66.16 3.12,65.21 5.66,65.21 6.35,64.52 6.35,63.65 7.33,62.67 8.2,62.67 8.89,61.98 8.89,60.88 9.67,60.11 9.72,60.11 9.75,60.13 22.26,60.13 22.39,60.27 26.02,60.27 27.23,61.48 U$1.150
  Bottom 0.4: v2.18,66.16 3.78,67.75 8.2,67.75 8.89,67.06 8.89,62.83 U$1.46
SCK
  Bottom 0.5: R2.2 49.59,38.42 48.72,39.3 48.72,44.12 ISP6.3 46.71,45.78 45.81,46.69 45.81,50.51 47.43,52.13 U1.19
SPI-CS0  (via drill 0.7)
  Top 0.4: U$1.185 23.12,18.3 | 23.12,18.3 U$1.159 | 22.88,18.24 U$1.185 | v18.76,19.49 18.76,18.3 23.12,18.3 | U$1.185 U$1.184
  Bottom 0.4: v18.76,19.49 9.75,19.49 8.56,18.3 U$1.55 U$1.81 U$1.80 | v18.76,19.49
SPI-MISO  (via drill 0.7)
  Top 0.4: U$1.157 25.47,13.24 26.82,14.58 26.82,16.33 27.58,17.09 31.72,17.09 32.41,16.4 32.41,11.11 26.89,5.59 18.75,5.59 v18.64,5.71
  Bottom 0.4: U$1.53 15.22,5.71 v18.64,5.71
SPI-MOSI  (via drill 0.7)
  Top 0.4: v19.06,13.33 22.84,13.33 U$1.183
  Bottom 0.4: v19.06,13.33 18.96,13.22 18.96,11.95 19.93,10.98 19.93,5.18 19.17,4.42 14.63,4.42 5.82,13.22 U$1.79
SPI-SCK  (via drill 0.7)
  Top 0.4: U$1.158 25.48,16.42 26.81,17.75 26.81,18.85 26.03,19.63 20.44,19.63 19.3,20.78 18.23,20.78 16.55,19.1 16.55,17.69 v16.5,17.65
  Bottom 0.4: U$1.54 8.56,15.76 9.89,17.09 15.95,17.09 v16.5,17.65
TX2  (via drill 0.7)
  Top 0.4: v33.27,56.89 32.41,57.75 27.53,57.75 26.34,58.94 U$1.175
  Bottom 0.4: U$1.71 8.56,58.94 9.76,60.14 17.33,60.14 22.39,55.07 29.13,55.07 29.17,55.03 29.2,55.06 31.21,55.06 33.03,56.89 v33.27,56.89
TX-MAIN  (via drill 0.7)  (1 unrouted)
  Top 0.4: U$1.140 26.71,34.77 21.19,34.77 20.76,34.34 20.76,31.18 17.34,27.76 v16.2,27.76
  Bottom 0.4: U$1.36 11.59,34.73 11.59,33.05 12.45,32.19 13.28,32.19 15.23,30.24 15.23,29.81 15.56,29.48 | 15.57,29.49 15.57,28.39 v16.2,27.76
TXD
  Bottom 0.5: JP7.5 82.39,34.13 R11.2 76.24,34.13 75.42,33.31 63.33,33.31 U1.3
TXD-MAIN  (via drill 0.7)
  Top 0.4: v33.11,62.75 33.11,61.37 33.15,61.33 30.72,61.33 U$1.124
  Bottom 0.4: U$1.20 20.06,61.48 21.39,62.81 29.9,62.81 30.01,62.69 33.05,62.69 v33.11,62.75
V_BAT-VAUX  (via drill 0.7)
  Top 0.4: U$1.179 U$1.205 18.27,69.1 17.44,68.27 15.37,68.27 13.33,70.31 4.81,70.31 4.35,70.77 v2.06,70.77
  Bottom 0.4: U$1.75 U$1.101 3.73,69.1 v2.06,70.77
VCC  (via drill 0.7)  (1 unrouted)
  Top 0.4: v46.09,37.2 46.09,34.04 55.85,24.29 v57.85,24.29
  Top 0.5: v64.83,43.88 64.83,42.61 62.9,40.67 57.95,40.67 57.92,40.7 | v57.8,47.08 57.82,47.06 57.82,40.7 57.92,40.7 | 57.92,40.7 57.9,40.7 57.85,40.7 57.85,24.86 v57.85,24.29
  Bottom 0.4: ISP6.2 44.51,38.78 v46.09,37.2
  Bottom 0.5: 57.9,21.65 R1.2 66.12,21.65 75.54,12.23 85.34,12.23 85.34,26.55 JP7.3 | U1.20 U1.21 54.7,47.08 v57.8,47.08 | v64.83,43.88 64.2,44.51 U1.7 | SET_VCC.2 47.05,24.67 48.73,26.34 51.73,26.34 56.42,21.65 57.85,21.65 57.88,21.65 57.88,24.26 v57.85,24.29
VIN
  Bottom 0.5: OUT4.2 61.19,85.15 63.09,87.06 72.93,87.06 74.83,85.15 OUT3.2 | OUT3.2 74.99,82.35 84.96,72.39 OUT2.2 85.31,72.3 87.68,69.94 87.68,58.63 86.69,57.64 OUT1.2 | SET_VIN.2 51.29,9.79 87.31,9.79 89.58,12.06 89.58,76.28 78.04,87.82 75.81,87.82 75.18,87.19 75.18,85.34 OUT3.2